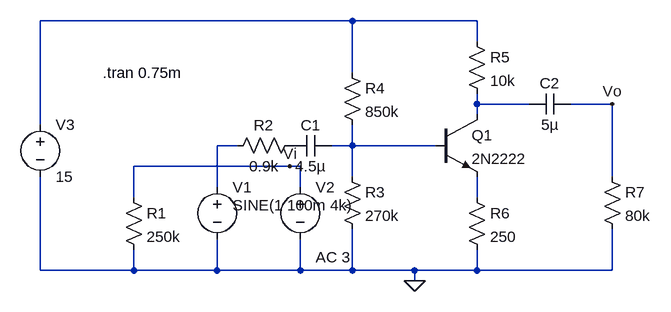
[diagram p0: schematic 3.asc]
3.asc, the LTspice schematic file:
Version 4
SHEET 1 880 680
WIRE 384 -96 -96 -96
WIRE 576 -96 384 -96
WIRE 576 -64 576 -96
WIRE 384 -16 384 -96
WIRE 576 32 576 16
WIRE 656 32 576 32
WIRE 784 32 720 32
WIRE 576 48 576 32
WIRE -96 64 -96 -96
WIRE 208 96 176 96
WIRE 384 96 384 64
WIRE 384 96 352 96
WIRE 512 96 384 96
WIRE 288 128 48 128
WIRE 304 128 288 128
WIRE 384 144 384 96
WIRE 784 144 784 32
WIRE 176 160 176 96
WIRE 304 160 304 128
WIRE 48 176 48 128
WIRE 576 176 576 144
WIRE -96 288 -96 144
WIRE 48 288 48 256
WIRE 48 288 -96 288
WIRE 176 288 176 240
WIRE 176 288 48 288
WIRE 304 288 304 240
WIRE 304 288 176 288
WIRE 384 288 384 224
WIRE 384 288 304 288
WIRE 480 288 384 288
WIRE 576 288 576 256
WIRE 576 288 480 288
WIRE 784 288 784 224
WIRE 784 288 576 288
WIRE 480 304 480 288
FLAG 480 304 0
FLAG 784 32 Vo
FLAG 288 128 Vi
SYMBOL res 32 160 R0
SYMATTR InstName R1
SYMATTR Value 250k
SYMBOL voltage 176 144 R0
WINDOW 123 24 72 Left 2
WINDOW 39 0 0 Left 0
WINDOW 3 24 44 Left 2
SYMATTR Value SINE(1 100m 4k)
SYMATTR InstName V1
SYMBOL voltage 304 144 R0
WINDOW 123 24 124 Left 2
WINDOW 39 0 0 Left 0
SYMATTR Value2 AC 3
SYMATTR InstName V2
SYMATTR Value ""
SYMBOL voltage -96 48 R0
WINDOW 123 0 0 Left 0
WINDOW 39 0 0 Left 0
SYMATTR InstName V3
SYMATTR Value 15
SYMBOL res 304 80 R90
WINDOW 0 0 56 VBottom 2
WINDOW 3 32 56 VTop 2
SYMATTR InstName R2
SYMATTR Value 0.9k
SYMBOL cap 352 80 R90
WINDOW 0 0 32 VBottom 2
WINDOW 3 32 32 VTop 2
SYMATTR InstName C1
SYMATTR Value 4.5µ
SYMBOL res 368 128 R0
SYMATTR InstName R3
SYMATTR Value 270k
SYMBOL res 368 -32 R0
SYMATTR InstName R4
SYMATTR Value 850k
SYMBOL npn 512 48 R0
SYMATTR InstName Q1
SYMATTR Value 2N2222
SYMBOL res 560 -80 R0
SYMATTR InstName R5
SYMATTR Value 10k
SYMBOL res 560 160 R0
SYMATTR InstName R6
SYMATTR Value 250
SYMBOL res 768 128 R0
SYMATTR InstName R7
SYMATTR Value 80k
SYMBOL cap 720 16 R90
WINDOW 0 0 32 VBottom 2
WINDOW 3 32 32 VTop 2
SYMATTR InstName C2
SYMATTR Value 5µ
TEXT 0 -16 Left 2 !.tran 0.75m

The netlist it stands for:
* 3.asc
R1 Vi 0 250k
V1 N003 0 SINE(1 100m 4k)
V2 Vi 0 AC 3
V3 N001 0 15
R2 P001 N003 0.9k
C1 N004 P001 4.5µ
R3 N004 0 270k
R4 N001 N004 850k
Q1 N002 N004 N005 0 2N2222
R5 N001 N002 10k
R6 N005 0 250
R7 Vo 0 80k
C2 Vo N002 5µ
.model NPN NPN
.model PNP PNP
.lib standard.bjt
.tran 0.75m
.backanno
.end